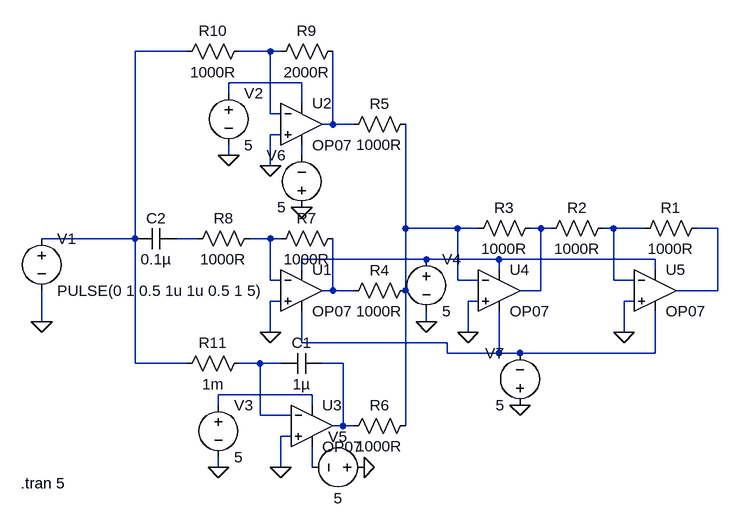
[diagram p0: schematic PID.asc]
PID.asc, the LTspice schematic file:
Version 4
SHEET 1 996 680
WIRE -80 -256 -160 -256
WIRE 48 -256 0 -256
WIRE 64 -256 48 -256
WIRE 96 -208 -16 -208
WIRE -16 -192 -16 -208
WIRE 96 -176 96 -208
WIRE 48 -160 48 -256
WIRE 64 -160 48 -160
WIRE 144 -144 144 -256
WIRE 144 -144 128 -144
WIRE 176 -144 144 -144
WIRE 64 -128 48 -128
WIRE -16 -96 -16 -112
WIRE 96 -96 96 -112
WIRE 48 -80 48 -128
WIRE 256 16 256 -144
WIRE 336 16 256 16
WIRE 368 16 336 16
WIRE 464 16 448 16
WIRE 480 16 464 16
WIRE 576 16 560 16
WIRE 624 16 576 16
WIRE 736 16 704 16
WIRE -160 32 -160 -256
WIRE -160 32 -304 32
WIRE -64 32 -96 32
WIRE 48 32 16 32
WIRE 64 32 48 32
WIRE 288 64 96 64
WIRE 400 64 288 64
WIRE 640 64 400 64
WIRE 96 80 96 64
WIRE 400 80 400 64
WIRE 640 80 640 64
WIRE 48 96 48 32
WIRE 64 96 48 96
WIRE 336 96 336 16
WIRE 368 96 336 96
WIRE 576 96 576 16
WIRE 608 96 576 96
WIRE 144 112 144 32
WIRE 144 112 128 112
WIRE 176 112 144 112
WIRE 256 112 256 16
WIRE 464 112 464 16
WIRE 464 112 432 112
WIRE 736 112 736 16
WIRE 736 112 672 112
WIRE 64 128 48 128
WIRE 368 128 352 128
WIRE 608 128 592 128
WIRE -304 160 -304 112
WIRE 288 160 288 144
WIRE 48 176 48 128
WIRE 352 176 352 128
WIRE 592 176 592 128
WIRE 96 192 96 144
WIRE 320 192 96 192
WIRE 320 208 320 192
WIRE 400 208 400 144
WIRE 400 208 320 208
WIRE 432 208 400 208
WIRE 640 208 640 144
WIRE 640 208 432 208
WIRE -160 224 -160 32
WIRE -80 224 -160 224
WIRE 32 224 0 224
WIRE 64 224 32 224
WIRE 160 224 128 224
WIRE 112 272 -32 272
WIRE -32 288 -32 272
WIRE 112 288 112 272
WIRE 32 304 32 224
WIRE 80 304 32 304
WIRE 160 320 160 224
WIRE 160 320 144 320
WIRE 176 320 160 320
WIRE 256 320 256 112
WIRE 80 336 64 336
WIRE -32 384 -32 368
WIRE 64 384 64 336
WIRE 112 384 112 352
FLAG 64 384 0
FLAG 48 176 0
FLAG 48 -80 0
FLAG 352 176 0
FLAG 592 176 0
FLAG -304 160 0
FLAG -16 -96 0
FLAG 96 -16 0
FLAG 288 160 0
FLAG 432 288 0
FLAG -32 384 0
FLAG 192 384 0
SYMBOL res 720 0 R90
WINDOW 0 0 56 VBottom 2
WINDOW 3 32 56 VTop 2
SYMATTR InstName R1
SYMATTR Value 1000R
SYMBOL res 576 0 R90
WINDOW 0 0 56 VBottom 2
WINDOW 3 32 56 VTop 2
SYMATTR InstName R2
SYMATTR Value 1000R
SYMBOL res 464 0 R90
WINDOW 0 0 56 VBottom 2
WINDOW 3 32 56 VTop 2
SYMATTR InstName R3
SYMATTR Value 1000R
SYMBOL res 272 96 R90
WINDOW 0 0 56 VBottom 2
WINDOW 3 32 56 VTop 2
SYMATTR InstName R4
SYMATTR Value 1000R
SYMBOL res 272 -160 R90
WINDOW 0 0 56 VBottom 2
WINDOW 3 32 56 VTop 2
SYMATTR InstName R5
SYMATTR Value 1000R
SYMBOL res 272 304 R90
WINDOW 0 0 56 VBottom 2
WINDOW 3 32 56 VTop 2
SYMATTR InstName R6
SYMATTR Value 1000R
SYMBOL res 160 16 R90
WINDOW 0 0 56 VBottom 2
WINDOW 3 32 56 VTop 2
SYMATTR InstName R7
SYMATTR Value 1000R
SYMBOL res 32 16 R90
WINDOW 0 0 56 VBottom 2
WINDOW 3 32 56 VTop 2
SYMATTR InstName R8
SYMATTR Value 1000R
SYMBOL res 160 -272 R90
WINDOW 0 0 56 VBottom 2
WINDOW 3 32 56 VTop 2
SYMATTR InstName R9
SYMATTR Value 2000R
SYMBOL res 16 -272 R90
WINDOW 0 0 56 VBottom 2
WINDOW 3 32 56 VTop 2
SYMATTR InstName R10
SYMATTR Value 1000R
SYMBOL cap 128 208 R90
WINDOW 0 0 32 VBottom 2
WINDOW 3 32 32 VTop 2
SYMATTR InstName C1
SYMATTR Value 1µ
SYMBOL cap -96 16 R90
WINDOW 0 0 32 VBottom 2
WINDOW 3 32 32 VTop 2
SYMATTR InstName C2
SYMATTR Value 0.1µ
SYMBOL res 16 208 R90
WINDOW 0 0 56 VBottom 2
WINDOW 3 32 56 VTop 2
SYMATTR InstName R11
SYMATTR Value 1m
SYMBOL voltage -304 16 R0
WINDOW 123 0 0 Left 0
WINDOW 39 0 0 Left 0
SYMATTR InstName V1
SYMATTR Value PULSE(0 1 0.5 1u 1u 0.5 1 5)
SYMBOL voltage -16 -208 R0
WINDOW 123 0 0 Left 0
WINDOW 39 0 0 Left 0
SYMATTR InstName V2
SYMATTR Value 5
SYMBOL voltage -32 272 R0
WINDOW 123 0 0 Left 0
WINDOW 39 0 0 Left 0
SYMATTR InstName V3
SYMATTR Value 5
SYMBOL voltage 288 48 R0
WINDOW 123 0 0 Left 0
WINDOW 39 0 0 Left 0
SYMATTR InstName V4
SYMATTR Value 5
SYMBOL OpAmps\\OP07 96 48 R0
SYMATTR InstName U1
SYMBOL OpAmps\\OP07 96 -208 R0
SYMATTR InstName U2
SYMBOL OpAmps\\OP07 112 256 R0
SYMATTR InstName U3
SYMBOL OpAmps\\OP07 400 48 R0
SYMATTR InstName U4
SYMBOL OpAmps\\OP07 640 48 R0
SYMATTR InstName U5
SYMBOL voltage 96 0 R180
WINDOW 0 24 96 Left 2
WINDOW 3 24 16 Left 2
WINDOW 123 0 0 Left 0
WINDOW 39 0 0 Left 0
SYMATTR InstName V6
SYMATTR Value 5
SYMBOL voltage 432 304 R180
WINDOW 0 24 96 Left 2
WINDOW 3 24 16 Left 2
WINDOW 123 0 0 Left 0
WINDOW 39 0 0 Left 0
SYMATTR InstName V7
SYMATTR Value 5
SYMBOL voltage 208 384 R90
WINDOW 0 -32 56 VBottom 2
WINDOW 3 32 56 VTop 2
WINDOW 123 0 0 Left 0
WINDOW 39 0 0 Left 0
SYMATTR InstName V5
SYMATTR Value 5
TEXT -336 408 Left 2 !.tran 5

The netlist it stands for:
* PID.asc
R1 N009 N008 1000R
R2 N008 N007 1000R
R3 N007 N006 1000R
R4 N006 N013 1000R
R5 N006 N004 1000R
R6 N006 N016 1000R
R7 N013 N011 1000R
R8 N011 N010 1000R
R9 N004 N002 2000R
R10 N002 N001 1000R
C1 N016 N015 1µ
C2 N010 N001 0.1µ
R11 N015 N001 1m
V1 N001 0 PULSE(0 1 0.5 1u 1u 0.5 1 5)
V2 N003 0 5
V3 N017 0 5
V4 N012 0 5
XU1 0 N011 N012 N014 N013 LT1001  ; OP07, pins In+ In- V+ V- OUT
XU2 0 N002 N003 N005 N004 LT1001  ; OP07, pins In+ In- V+ V- OUT
XU3 0 N015 N017 N018 N016 LT1001  ; OP07, pins In+ In- V+ V- OUT
XU4 0 N006 N012 N014 N007 LT1001  ; OP07, pins In+ In- V+ V- OUT
XU5 0 N008 N012 N014 N009 LT1001  ; OP07, pins In+ In- V+ V- OUT
V6 0 N005 5
V7 0 N014 5
V5 0 N018 5
.tran 5
.lib LTC.lib
.backanno
.end